# Altium schematic sheet SysOverView.SchDoc
size A2; SheetNumber: 1; SheetTotal: 7
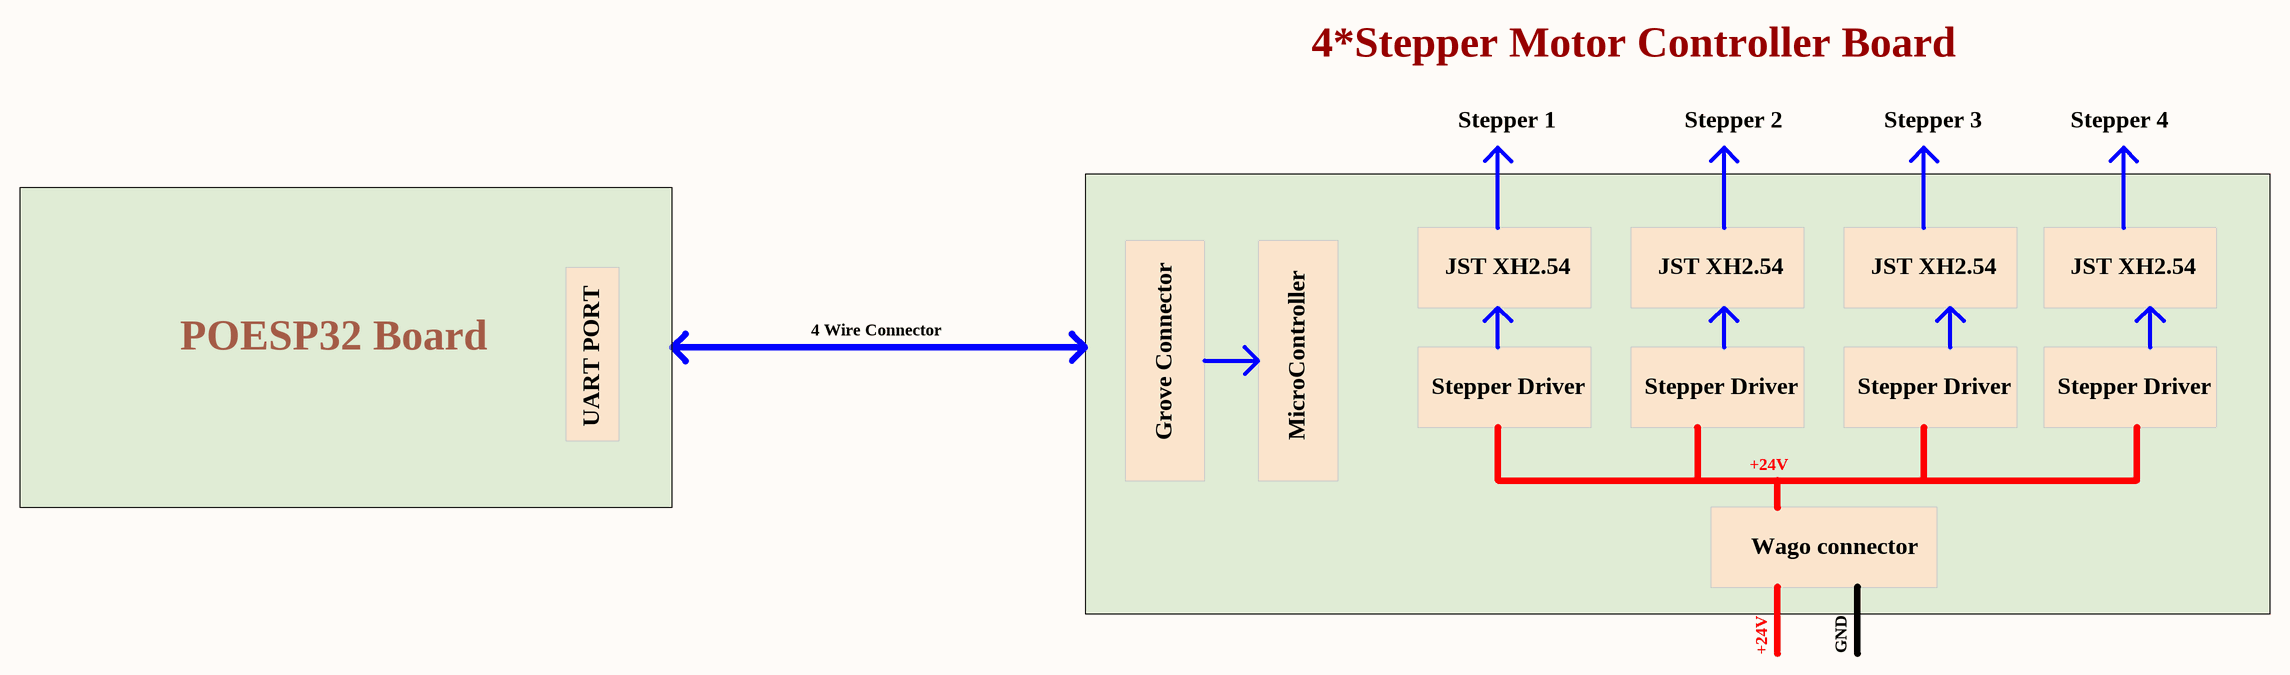
[diagram p0: SysOverView.SchDoc]

## Notes on the sheet
- 4*Stepper Motor Controller Board
- Stepper 1
- Stepper 2
- Stepper 3
- Stepper 4
- JST XH2.54
- POESP32 Board
- 4 Wire Connector
- UART PORT
- Grove Connector
- MicroController
- Stepper Driver
- +24V
- Wago connector
- GND